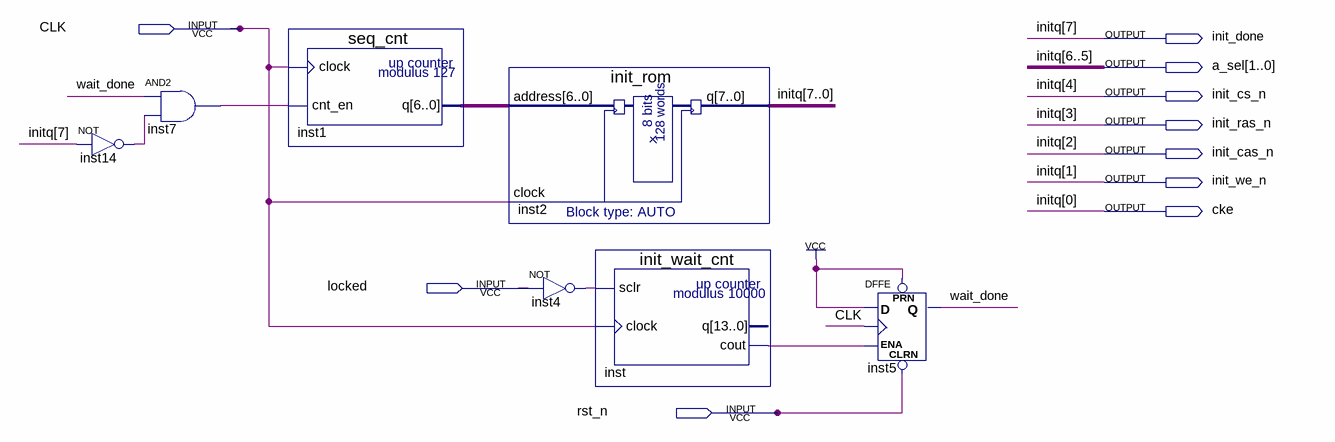
[diagram p0: schematic sheet]
// Quartus schematic sdram_init.bdf as structural Verilog: 7 symbols, 10 pins
module sdram_init (
  input  CLK,
  input  locked,
  input  rst_n,
  output init_done,
  output [1:0] a_sel,
  output init_cs_n,
  output init_ras_n,
  output init_cas_n,
  output init_we_n,
  output cke
);

  wire inst4_out, inst7_out, inst14_out, inst_cout, wait_done;
  wire [6:0] inst1_q;

  not inst14 (inst14_out, init_done);
  and inst7 (inst7_out, wait_done, inst14_out);
  seq_cnt inst1 (.clock(CLK), .cnt_en(inst7_out), .q(inst1_q));
  init_rom inst2 (
    .address(inst1_q), .clock(CLK), .q({init_done, a_sel, init_cs_n, init_ras_n, init_cas_n, init_we_n, cke}));
  not inst4 (inst4_out, locked);
  init_wait_cnt inst (.sclr(inst4_out), .clock(CLK), .cout(inst_cout));  // open: q
  DFFE inst5 (.PRN(1'b1), .CLRN(rst_n), .D(1'b1), .CLK(CLK), .ENA(inst_cout), .Q(wait_done));

  // Other names for the same wires on the sheet: initq[7:0] = {init_done, a_sel, init_cs_n, init_ras_n, init_cas_n, init_we_n, cke}
endmodule
